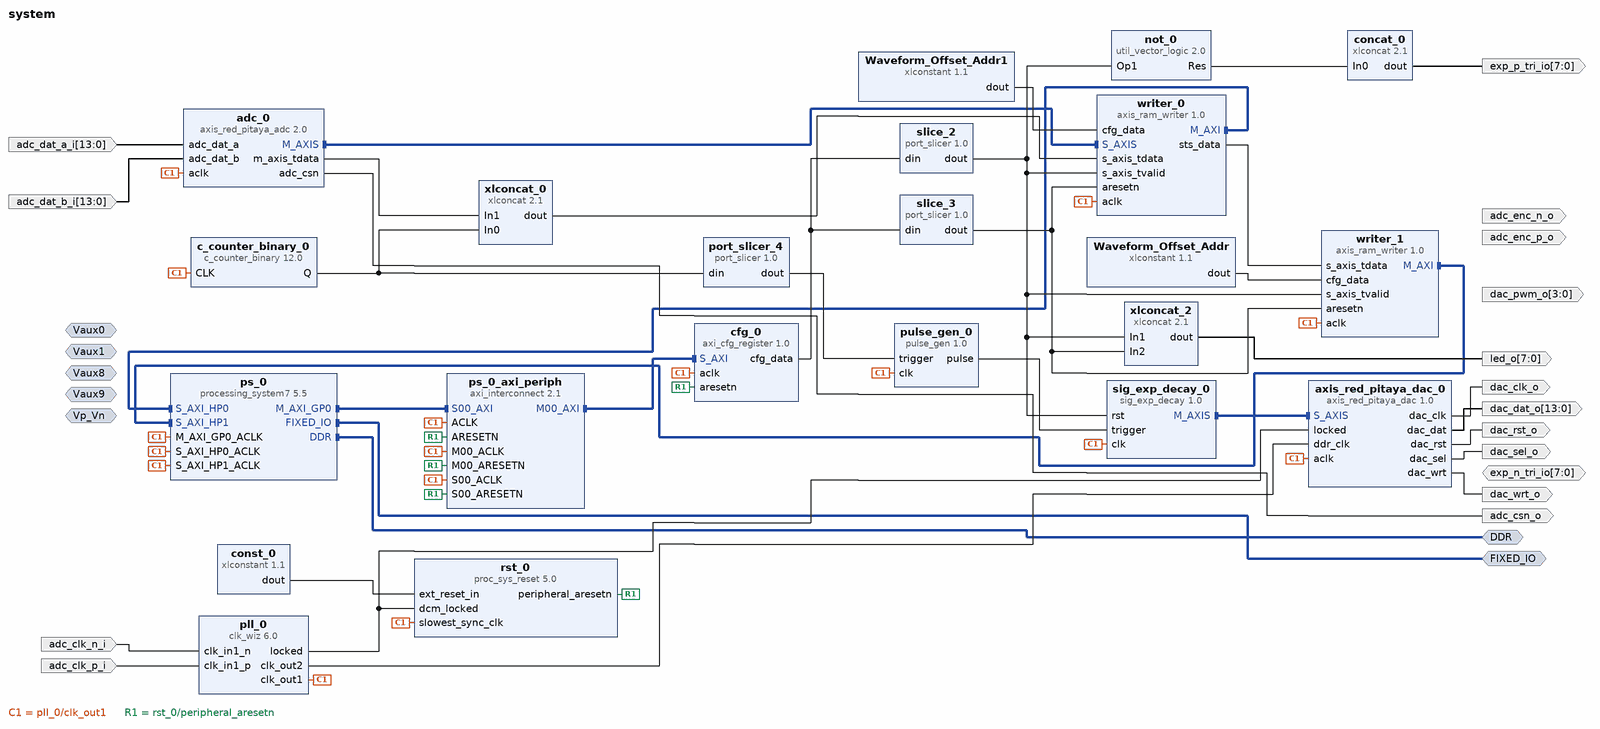
[diagram p0: block diagram of the top level]
# Vivado block design system, xc7z010clg400-1, Vivado 2019.2
create_bd_design system

create_bd_intf_port -mode Master -vlnv xilinx.com:interface:ddrx_rtl:1.0 DDR
create_bd_intf_port -mode Master -vlnv xilinx.com:display_processing_system7:fixedio_rtl:1.0 FIXED_IO
create_bd_intf_port -mode Slave -vlnv xilinx.com:interface:diff_analog_io_rtl:1.0 Vaux0
create_bd_intf_port -mode Slave -vlnv xilinx.com:interface:diff_analog_io_rtl:1.0 Vaux1
create_bd_intf_port -mode Slave -vlnv xilinx.com:interface:diff_analog_io_rtl:1.0 Vaux8
create_bd_intf_port -mode Slave -vlnv xilinx.com:interface:diff_analog_io_rtl:1.0 Vaux9
create_bd_intf_port -mode Slave -vlnv xilinx.com:interface:diff_analog_io_rtl:1.0 Vp_Vn
create_bd_port -dir I adc_clk_n_i
create_bd_port -dir I adc_clk_p_i
create_bd_port -dir O adc_csn_o
create_bd_port -dir I -from 13 -to 0 adc_dat_a_i
create_bd_port -dir I -from 13 -to 0 adc_dat_b_i
create_bd_port -dir O adc_enc_n_o
create_bd_port -dir O adc_enc_p_o
create_bd_port -dir O dac_clk_o
create_bd_port -dir O -from 13 -to 0 dac_dat_o
create_bd_port -dir O -from 3 -to 0 dac_pwm_o
create_bd_port -dir O dac_rst_o
create_bd_port -dir O dac_sel_o
create_bd_port -dir O dac_wrt_o
create_bd_port -dir IO -from 7 -to 0 exp_n_tri_io
create_bd_port -dir O -from 7 -to 0 exp_p_tri_io
create_bd_port -dir O -from 7 -to 0 led_o

create_bd_cell -type ip -vlnv xilinx.com:ip:xlconstant:1.1 Waveform_Offset_Addr
set_property -dict {CONFIG.CONST_VAL 402653184 CONFIG.CONST_WIDTH 32} [get_bd_cells Waveform_Offset_Addr]
create_bd_cell -type ip -vlnv pavel-demin:user:axis_red_pitaya_adc:2.0 adc_0
set_property -dict {CONFIG.ADC_DATA_WIDTH 14} [get_bd_cells adc_0]
create_bd_cell -type ip -vlnv pavel-demin:user:axis_red_pitaya_dac:1.0 axis_red_pitaya_dac_0
create_bd_cell -type ip -vlnv xilinx.com:ip:c_counter_binary:12.0 c_counter_binary_0
set_property -dict {CONFIG.Implementation DSP48 CONFIG.Output_Width 48} [get_bd_cells c_counter_binary_0]
create_bd_cell -type ip -vlnv pavel-demin:user:axi_cfg_register:1.0 cfg_0
set_property -dict {CONFIG.AXI_ADDR_WIDTH 32 CONFIG.AXI_DATA_WIDTH 32 CONFIG.CFG_DATA_WIDTH 256} [get_bd_cells cfg_0]
create_bd_cell -type ip -vlnv xilinx.com:ip:xlconcat:2.1 concat_0
set_property -dict {CONFIG.IN0_WIDTH 1 CONFIG.IN1_WIDTH 7 CONFIG.NUM_PORTS 2} [get_bd_cells concat_0]
create_bd_cell -type ip -vlnv xilinx.com:ip:xlconstant:1.1 const_0
create_bd_cell -type ip -vlnv xilinx.com:ip:util_vector_logic:2.0 not_0
set_property -dict {CONFIG.C_OPERATION not CONFIG.C_SIZE 1} [get_bd_cells not_0]
create_bd_cell -type ip -vlnv xilinx.com:ip:clk_wiz:6.0 pll_0
set_property -dict [list \
  CONFIG.CLKOUT1_JITTER 119.348 \
  CONFIG.CLKOUT1_PHASE_ERROR 96.948 \
  CONFIG.CLKOUT1_REQUESTED_OUT_FREQ 125.0 \
  CONFIG.CLKOUT1_USED true \
  CONFIG.CLKOUT2_JITTER 104.759 \
  CONFIG.CLKOUT2_PHASE_ERROR 96.948 \
  CONFIG.CLKOUT2_REQUESTED_OUT_FREQ 250.0 \
  CONFIG.CLKOUT2_REQUESTED_PHASE -90 \
  CONFIG.CLKOUT2_USED true \
  CONFIG.MMCM_CLKFBOUT_MULT_F 8 \
  CONFIG.MMCM_CLKOUT0_DIVIDE_F 8 \
  CONFIG.MMCM_CLKOUT1_DIVIDE 4 \
  CONFIG.MMCM_CLKOUT1_PHASE -90.000 \
  CONFIG.NUM_OUT_CLKS 2 \
  CONFIG.PRIMITIVE PLL \
  CONFIG.PRIM_IN_FREQ 125.0 \
  CONFIG.PRIM_SOURCE Differential_clock_capable_pin \
  CONFIG.USE_RESET false \
] [get_bd_cells pll_0]
create_bd_cell -type ip -vlnv pavel-demin:user:port_slicer:1.0 port_slicer_4
set_property -dict {CONFIG.DIN_FROM 16 CONFIG.DIN_TO 16 CONFIG.DIN_WIDTH 48} [get_bd_cells port_slicer_4]
create_bd_cell -type ip -vlnv xilinx.com:ip:processing_system7:5.5 ps_0
set_property -dict [list \
  CONFIG.PCW_APU_PERIPHERAL_FREQMHZ 666.666666 \
  CONFIG.PCW_ENET0_ENET0_IO {MIO 16 .. 27} \
  CONFIG.PCW_ENET0_GRP_MDIO_ENABLE 1 \
  CONFIG.PCW_ENET0_GRP_MDIO_IO {MIO 52 .. 53} \
  CONFIG.PCW_ENET0_PERIPHERAL_ENABLE 1 \
  CONFIG.PCW_ENET0_RESET_ENABLE 0 \
  CONFIG.PCW_ENET_RESET_ENABLE 1 \
  CONFIG.PCW_ENET_RESET_SELECT {Share reset pin} \
  CONFIG.PCW_FPGA0_PERIPHERAL_FREQMHZ 50 \
  CONFIG.PCW_FPGA1_PERIPHERAL_FREQMHZ 50 \
  CONFIG.PCW_GPIO_EMIO_GPIO_ENABLE 1 \
  CONFIG.PCW_GPIO_EMIO_GPIO_IO 64 \
  CONFIG.PCW_GPIO_MIO_GPIO_ENABLE 1 \
  CONFIG.PCW_GPIO_MIO_GPIO_IO MIO \
  CONFIG.PCW_GPIO_PERIPHERAL_ENABLE 1 \
  CONFIG.PCW_I2C0_GRP_INT_ENABLE 0 \
  CONFIG.PCW_I2C0_I2C0_IO {MIO 50 .. 51} \
  CONFIG.PCW_I2C0_PERIPHERAL_ENABLE 1 \
  CONFIG.PCW_I2C_PERIPHERAL_FREQMHZ 111.111115 \
  CONFIG.PCW_I2C_RESET_ENABLE 1 \
  CONFIG.PCW_I2C_RESET_SELECT {Share reset pin} \
  CONFIG.PCW_IMPORT_BOARD_PRESET cfg/red_pitaya.xml \
  CONFIG.PCW_PERIPHERAL_BOARD_PRESET None \
  CONFIG.PCW_PRESET_BANK1_VOLTAGE {LVCMOS 2.5V} \
  CONFIG.PCW_QSPI_PERIPHERAL_ENABLE 0 \
  CONFIG.PCW_SD0_GRP_CD_ENABLE 1 \
  CONFIG.PCW_SD0_GRP_CD_IO {MIO 46} \
  CONFIG.PCW_SD0_GRP_WP_ENABLE 1 \
  CONFIG.PCW_SD0_GRP_WP_IO {MIO 47} \
  CONFIG.PCW_SD0_PERIPHERAL_ENABLE 1 \
  CONFIG.PCW_SD0_SD0_IO {MIO 40 .. 45} \
  CONFIG.PCW_SDIO_PERIPHERAL_FREQMHZ 100 \
  CONFIG.PCW_SPI0_PERIPHERAL_ENABLE 1 \
  CONFIG.PCW_SPI0_SPI0_IO EMIO \
  CONFIG.PCW_SPI1_PERIPHERAL_ENABLE 1 \
  CONFIG.PCW_SPI1_SPI1_IO {MIO 10 .. 15} \
  CONFIG.PCW_S_AXI_HP1_DATA_WIDTH 32 \
  CONFIG.PCW_UART0_PERIPHERAL_ENABLE 1 \
  CONFIG.PCW_UART0_UART0_IO {MIO 14 .. 15} \
  CONFIG.PCW_UART1_PERIPHERAL_ENABLE 1 \
  CONFIG.PCW_UART1_UART1_IO {MIO 8 .. 9} \
  CONFIG.PCW_UART_PERIPHERAL_FREQMHZ 100 \
  CONFIG.PCW_UIPARAM_DDR_BUS_WIDTH {16 Bit} \
  CONFIG.PCW_UIPARAM_DDR_FREQ_MHZ 533.333333 \
  CONFIG.PCW_UIPARAM_DDR_PARTNO {MT41J256M16 RE-125} \
  CONFIG.PCW_USB0_PERIPHERAL_ENABLE 1 \
  CONFIG.PCW_USB0_RESET_ENABLE 1 \
  CONFIG.PCW_USB0_RESET_IO {MIO 48} \
  CONFIG.PCW_USB0_USB0_IO {MIO 28 .. 39} \
  CONFIG.PCW_USB_RESET_ENABLE 1 \
  CONFIG.PCW_USB_RESET_SELECT {Share reset pin} \
  CONFIG.PCW_USE_S_AXI_HP0 1 \
  CONFIG.PCW_USE_S_AXI_HP1 1 \
] [get_bd_cells ps_0]
# 510 more settings of ps_0 are not shown: defaults, MIO pin electricals, DDR timing, and values the tool derives
create_bd_cell -type ip -vlnv xilinx.com:ip:axi_interconnect:2.1 ps_0_axi_periph
set_property -dict {CONFIG.NUM_MI 1} [get_bd_cells ps_0_axi_periph]
create_bd_cell -type ip -vlnv user.org:user:pulse_gen:1.0 pulse_gen_0
create_bd_cell -type ip -vlnv xilinx.com:ip:proc_sys_reset:5.0 rst_0
create_bd_cell -type ip -vlnv user.org:user:sig_exp_decay:1.0 sig_exp_decay_0
create_bd_cell -type ip -vlnv pavel-demin:user:port_slicer:1.0 slice_2
set_property -dict {CONFIG.DIN_FROM 1 CONFIG.DIN_TO 1 CONFIG.DIN_WIDTH 256} [get_bd_cells slice_2]
create_bd_cell -type ip -vlnv pavel-demin:user:port_slicer:1.0 slice_3
set_property -dict {CONFIG.DIN_FROM 2 CONFIG.DIN_TO 2 CONFIG.DIN_WIDTH 256} [get_bd_cells slice_3]
create_bd_cell -type ip -vlnv pavel-demin:user:axis_ram_writer:1.0 writer_0
set_property -dict {CONFIG.ADDR_WIDTH 24 CONFIG.AXIS_TDATA_WIDTH 64} [get_bd_cells writer_0]
create_bd_cell -type ip -vlnv xilinx.com:ip:xlconcat:2.1 xlconcat_2
set_property -dict {CONFIG.NUM_PORTS 8} [get_bd_cells xlconcat_2]
create_bd_cell -type ip -vlnv xilinx.com:ip:xlconcat:2.1 xlconcat_0
set_property -dict {CONFIG.IN0_WIDTH 32 CONFIG.IN1_WIDTH 32} [get_bd_cells xlconcat_0]
create_bd_cell -type ip -vlnv pavel-demin:user:axis_ram_writer:1.0 writer_1
set_property -dict {CONFIG.ADDR_WIDTH 4 CONFIG.AXIS_TDATA_WIDTH 32 CONFIG.AXI_DATA_WIDTH 32} [get_bd_cells writer_1]
create_bd_cell -type ip -vlnv xilinx.com:ip:xlconstant:1.1 Waveform_Offset_Addr1
set_property -dict {CONFIG.CONST_VAL 268435456 CONFIG.CONST_WIDTH 32} [get_bd_cells Waveform_Offset_Addr1]

# ---- connections ----

connect_bd_intf_net [get_bd_intf_pins adc_0/M_AXIS] [get_bd_intf_pins writer_0/S_AXIS]
connect_bd_intf_net [get_bd_intf_pins axis_red_pitaya_dac_0/S_AXIS] [get_bd_intf_pins sig_exp_decay_0/M_AXIS]
connect_bd_intf_net [get_bd_intf_pins ps_0/S_AXI_HP0] [get_bd_intf_pins writer_0/M_AXI]
connect_bd_intf_net [get_bd_intf_pins cfg_0/S_AXI] [get_bd_intf_pins ps_0_axi_periph/M00_AXI]
connect_bd_intf_net [get_bd_intf_pins ps_0/M_AXI_GP0] [get_bd_intf_pins ps_0_axi_periph/S00_AXI]
connect_bd_intf_net [get_bd_intf_ports FIXED_IO] [get_bd_intf_pins ps_0/FIXED_IO]
connect_bd_intf_net [get_bd_intf_ports DDR] [get_bd_intf_pins ps_0/DDR]
connect_bd_intf_net [get_bd_intf_pins ps_0/S_AXI_HP1] [get_bd_intf_pins writer_1/M_AXI]
connect_bd_net [get_bd_pins adc_0/adc_csn] [get_bd_ports adc_csn_o]
connect_bd_net [get_bd_ports adc_clk_n_i] [get_bd_pins pll_0/clk_in1_n]
connect_bd_net [get_bd_ports adc_clk_p_i] [get_bd_pins pll_0/clk_in1_p]
connect_bd_net [get_bd_ports adc_dat_a_i] [get_bd_pins adc_0/adc_dat_a]
connect_bd_net [get_bd_ports adc_dat_b_i] [get_bd_pins adc_0/adc_dat_b]
connect_bd_net [get_bd_pins axis_red_pitaya_dac_0/dac_clk] [get_bd_ports dac_clk_o]
connect_bd_net [get_bd_pins axis_red_pitaya_dac_0/dac_dat] [get_bd_ports dac_dat_o]
connect_bd_net [get_bd_pins axis_red_pitaya_dac_0/dac_rst] [get_bd_ports dac_rst_o]
connect_bd_net [get_bd_pins axis_red_pitaya_dac_0/dac_sel] [get_bd_ports dac_sel_o]
connect_bd_net [get_bd_pins axis_red_pitaya_dac_0/dac_wrt] [get_bd_ports dac_wrt_o]
connect_bd_net [get_bd_pins c_counter_binary_0/Q] [get_bd_pins port_slicer_4/din] [get_bd_pins xlconcat_0/In0]
connect_bd_net [get_bd_pins cfg_0/cfg_data] [get_bd_pins slice_2/din] [get_bd_pins slice_3/din]
connect_bd_net [get_bd_pins concat_0/dout] [get_bd_ports exp_p_tri_io]
connect_bd_net [get_bd_pins const_0/dout] [get_bd_pins rst_0/ext_reset_in]
connect_bd_net -net const_1_dout [get_bd_pins Waveform_Offset_Addr/dout] [get_bd_pins writer_1/cfg_data]
connect_bd_net [get_bd_pins not_0/Res] [get_bd_pins concat_0/In0]
connect_bd_net [get_bd_pins pll_0/clk_out1] \
  [get_bd_pins adc_0/aclk] [get_bd_pins axis_red_pitaya_dac_0/aclk] [get_bd_pins c_counter_binary_0/CLK] \
  [get_bd_pins ps_0/M_AXI_GP0_ACLK] [get_bd_pins ps_0/S_AXI_HP0_ACLK] [get_bd_pins ps_0_axi_periph/ACLK] \
  [get_bd_pins ps_0_axi_periph/M00_ACLK] [get_bd_pins ps_0_axi_periph/S00_ACLK] [get_bd_pins rst_0/slowest_sync_clk] \
  [get_bd_pins writer_0/aclk] [get_bd_pins sig_exp_decay_0/clk] [get_bd_pins cfg_0/aclk] [get_bd_pins pulse_gen_0/clk] \
  [get_bd_pins writer_1/aclk] [get_bd_pins ps_0/S_AXI_HP1_ACLK]
connect_bd_net [get_bd_pins pll_0/clk_out2] [get_bd_pins axis_red_pitaya_dac_0/ddr_clk]
connect_bd_net [get_bd_pins pll_0/locked] [get_bd_pins axis_red_pitaya_dac_0/locked] [get_bd_pins rst_0/dcm_locked]
connect_bd_net [get_bd_pins port_slicer_4/dout] [get_bd_pins pulse_gen_0/trigger]
connect_bd_net [get_bd_pins pulse_gen_0/pulse] [get_bd_pins sig_exp_decay_0/trigger]
connect_bd_net [get_bd_pins rst_0/peripheral_aresetn] \
  [get_bd_pins ps_0_axi_periph/ARESETN] [get_bd_pins ps_0_axi_periph/M00_ARESETN] [get_bd_pins ps_0_axi_periph/S00_ARESETN] \
  [get_bd_pins cfg_0/aresetn]
connect_bd_net [get_bd_pins slice_2/dout] \
  [get_bd_pins not_0/Op1] [get_bd_pins sig_exp_decay_0/rst] [get_bd_pins xlconcat_2/In1] [get_bd_pins writer_0/s_axis_tvalid] \
  [get_bd_pins writer_1/s_axis_tvalid]
connect_bd_net [get_bd_pins slice_3/dout] [get_bd_pins writer_0/aresetn] [get_bd_pins xlconcat_2/In2] [get_bd_pins writer_1/aresetn]
connect_bd_net [get_bd_pins xlconcat_2/dout] [get_bd_ports led_o]
connect_bd_net [get_bd_pins xlconcat_0/dout] [get_bd_pins writer_0/s_axis_tdata]
connect_bd_net [get_bd_pins adc_0/m_axis_tdata] [get_bd_pins xlconcat_0/In1]
connect_bd_net [get_bd_pins writer_0/sts_data] [get_bd_pins writer_1/s_axis_tdata]
connect_bd_net [get_bd_pins Waveform_Offset_Addr1/dout] [get_bd_pins writer_0/cfg_data]

# ---- address map ----
assign_bd_address -offset 0x40000000 -range 4K -target_address_space [get_bd_addr_spaces ps_0/Data] [get_bd_addr_segs cfg_0/s_axi/reg0]
assign_bd_address -offset 0x00000000 -range 512M -target_address_space [get_bd_addr_spaces writer_0/M_AXI] [get_bd_addr_segs ps_0/S_AXI_HP0/HP0_DDR_LOWOCM]
assign_bd_address -offset 0x00000000 -range 512M -target_address_space [get_bd_addr_spaces writer_1/M_AXI] [get_bd_addr_segs ps_0/S_AXI_HP1/HP1_DDR_LOWOCM]

validate_bd_design
save_bd_design
